# Altium schematic sheet MCU.SchDoc
size A4; SheetNumber: 2; SheetTotal: 8
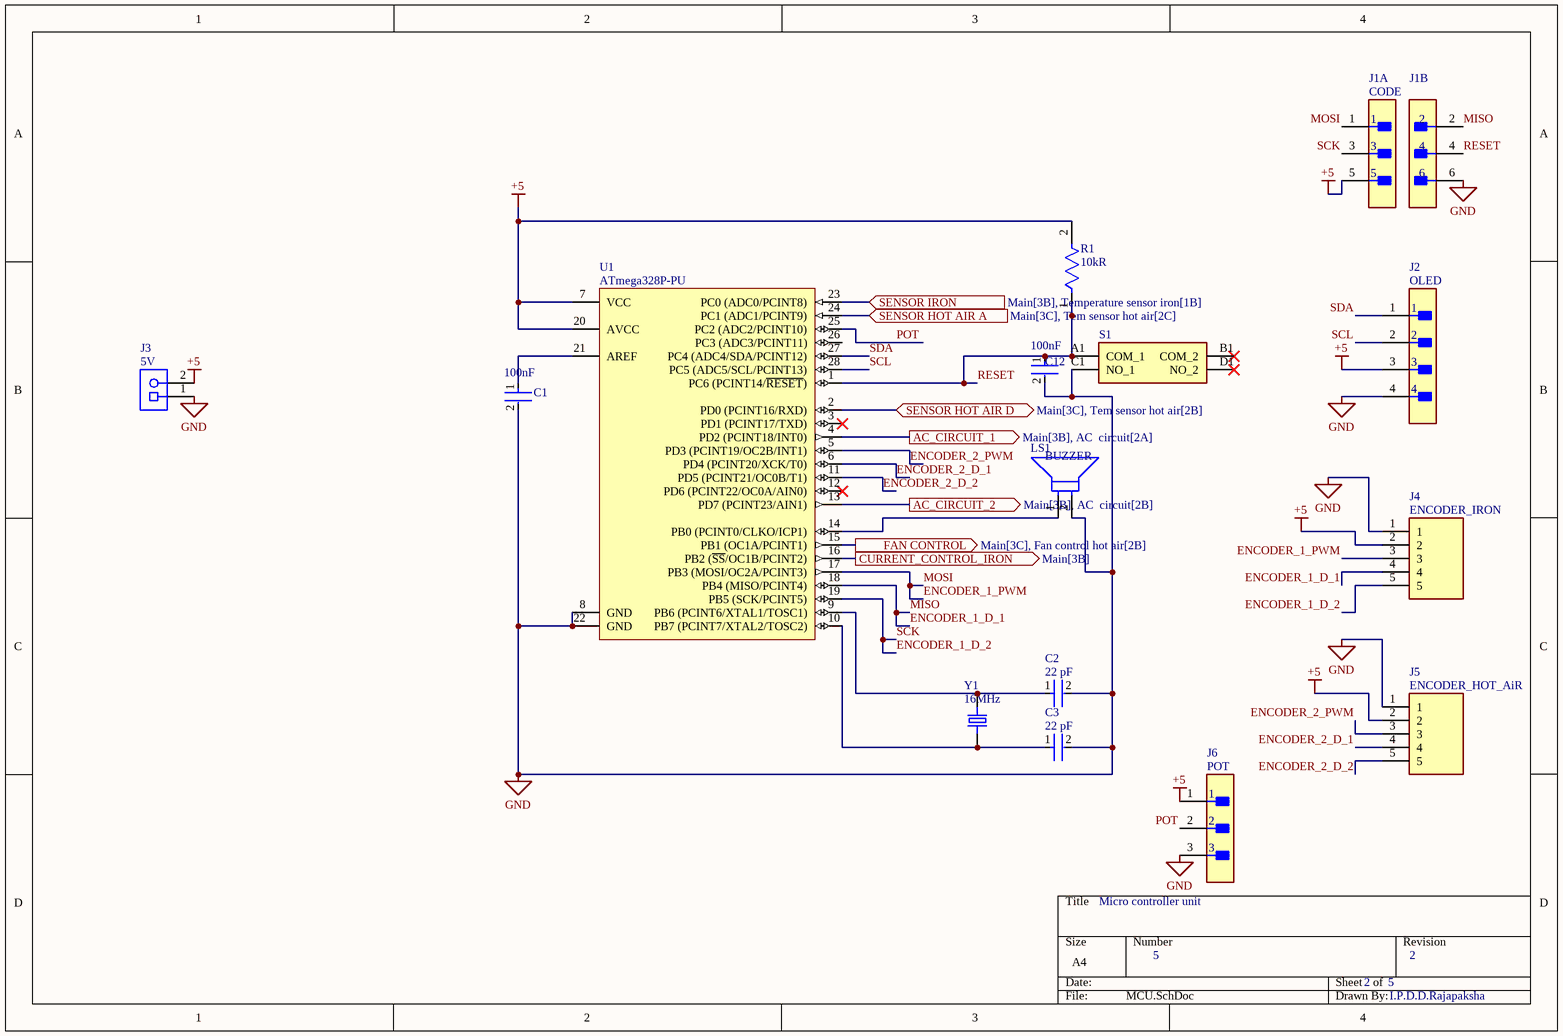
[diagram p0: MCU.SchDoc]

## Parts
C1  Capacitance: 100nF  [FP-0805-L_2_01_0_2-W_1_25-IPC_A]  (hidden comment: 0805YC104M4T2A)
C2  Capacitance: 22 pF  [FP-C0805C-DN-MFG]  (hidden comment: C0805C220J5GACTU)
C3  Capacitance: 22 pF  [FP-C0805C-DN-MFG]  (hidden comment: C0805C220J5GACTU)
C12  Capacitance: 100nF  [FP-0805-L_2_01_0_2-W_1_25-IPC_A]  (hidden comment: 0805YC104M4T2A)
J1  Parameter 1: CODE  [FP-90131-0763-MFG]  (hidden comment: 90131-0763)  (parts A,B of 2)
J2  value OLED  [FP-B4B-XH-A_LF_SN-MFG]  (hidden comment: B4B-XH-A(LF)(SN))
J3  Parameter 1: 5V  [PHOE-1729128-2_V]  (hidden comment: 1729128)
J4  Parameter 1: ENCODER_IRON  [B5BXHAMLFSN]  (hidden comment: B5B-XH-AM__LF__SN_)
J5  Parameter 1: ENCODER_HOT_AiR  [B5BXHAMLFSN]  (hidden comment: B5B-XH-AM__LF__SN_)
J6  Parameter 1: POT  [FP-B3B-XH-A_LF_SN-MFG]  (hidden comment: B3B-XH-A(LF)(SN))
LS1  Parameter 1: BUZZER  [FP-AI-1223-TWT-5V-R-MFG]  (hidden comment: AI-1223-TWT-5V-R)
R1  Resistance: 10kR  [FP-CRCW1206-e3-IPC_C]  (hidden comment: CRCW120610K0FKEA)
S1  TS-1187A-B-A-B  [TS1187ABAB]  (value not drawn)
U1  ATmega328P-PU  [28P3]
Y1  value 16MHz  [XTAL_ECS-160-20-4X]  (hidden comment: ECS-160-S-4)

## Ports
AC_CIRCUIT_1 (out, see Main[3B], AC  circuit[2A]), AC_CIRCUIT_2 (out, see Main[3B], AC  circuit[2B]), CURRENT_CONTROL_IRON (out, see Main[3B]), FAN CONTROL (out, see Main[3C], Fan control hot air[2B]), SENSOR HOT AIR A (in, see Main[3C], Tem sensor hot air[2C]), SENSOR HOT AIR D (bidir, see Main[3C], Tem sensor hot air[2B]), SENSOR IRON (in, see Main[3B], Temperature sensor iron[1B])

## Nets
+5: J1.5 J2.3 J3.2 J4.2 J5.2 J6.1 R1.2 U1.7(VCC) U1.20(AVCC)
GND: C1.2 C2.2 C3.2 C12.2 J1.6 J2.4 J3.1 J4.1 J5.1 J6.3 LS1.2(A) S1.C1(NO_1) U1.8(GND) U1.22(GND)
AC_CIRCUIT_1: U1.4(PD2_(PCINT18/INT0)) ; port AC_CIRCUIT_1
AC_CIRCUIT_2: U1.13(PD7_(PCINT23/AIN1)) ; port AC_CIRCUIT_2
CURRENT_CONTROL_IRON: U1.16(PB2_(~{SS}/OC1B/PCINT2)) ; port CURRENT_CONTROL_IRON
ENCODER_1_D_1: J1.2 J4.4 U1.18(PB4_(MISO/PCINT4))  [also labelled MISO]
ENCODER_1_D_2: J1.3 J4.5 U1.19(PB5_(SCK/PCINT5))  [also labelled SCK]
ENCODER_1_PWM: J1.1 J4.3 U1.17(PB3_(MOSI/OC2A/PCINT3))  [also labelled MOSI]
ENCODER_2_D_1: J5.4 U1.6(PD4_(PCINT20/XCK/T0))
ENCODER_2_D_2: J5.5 U1.11(PD5_(PCINT21/OC0B/T1))
ENCODER_2_PWM: J5.3 U1.5(PD3_(PCINT19/OC2B/INT1))
FAN CONTROL: U1.15(PB1_(OC1A/PCINT1)) ; port FAN CONTROL
POT: J6.2 U1.25(PC2_(ADC2/PCINT10))
RESET: C12.1 J1.4 R1.1 S1.A1(COM_1) U1.1(PC6_(PCINT14/~{RESET}))
SCL: J2.2 U1.28(PC5_(ADC5/SCL/PCINT13))
SDA: J2.1 U1.27(PC4_(ADC4/SDA/PCINT12))
SENSOR HOT AIR A: U1.24(PC1_(ADC1/PCINT9)) ; port SENSOR HOT AIR A
SENSOR HOT AIR D: U1.2(PD0_(PCINT16/RXD)) ; port SENSOR HOT AIR D
SENSOR IRON: U1.23(PC0_(ADC0/PCINT8)) ; port SENSOR IRON
NetC1_1: C1.1 U1.21(AREF)
NetC2_1: C2.1 U1.9(PB6_(PCINT6/XTAL1/TOSC1)) Y1.2
NetC3_1: C3.1 U1.10(PB7_(PCINT7/XTAL2/TOSC2)) Y1.1
NetLS1_1: LS1.1(C) U1.14(PB0_(PCINT0/CLKO/ICP1))

Not connected (* = marked no-connect by the designer): S1 B1(COM_2)* D1(NO_2)*; U1 3(PD1_(PCINT17/TXD))* 12(PD6_(PCINT22/OC0A/AIN0))* 26(PC3_(ADC3/PCINT11))

## Notes on the sheet
- (near J6) Micro controller unit
- 5
- 2      5
- 2
- I.P.D.D.Rajapaksha

## Library data of the parts
C1 C12 = CMP-04427-015812-1: Automotive Ceramic Capacitor, 0805, 100nF, 20%, X7R, 0.15, 16V; Termination: SMD/SMT; Case Code (Metric): 2012; Length: 0.079inch; Dielectric: X7R; Max Operating Temperature: 125°C; Thickness: 0.037inch; Ratings: AEC-Q200; Package Quantity: 4000; Weight: 0.000194oz; Voltage Rating: 16V; Voltage Rating (DC): 16V; Mount: Surface Mount; Width: 1.25mm; Packaging: Tape and Reel; Tolerance: 20%; Case/Package: 0805; Height: 0.94mm; Case Code (Imperial): 0805; Min Operating Temperature: -55°C
C2 C3 = CMP-2007-00048-2: Capacitor; Ceramic; Cap; 22.0pF; Tol 5%; SMT; Vol-Rtg 50V; C0G; Tape and Reel; Manufacturer: KEMET; Temperature Coefficient: 30ppm/°C; Value: 22 pF; Tolerance: 0.05; Device Class L1: Passive Components; Mouser Description: Multilayer Ceramic Capacitors MLCC - SMD/SMT 50volts 22pF C0G 5%; Temperature Range Low: -55°C; Automotive: No; Voltage Rating: 50 V; Material: Ceramic; Category: Cap; Height: 0.88mm; Temperature Range High: +125°C; Digikey Description: Capacitor; Ceramic; Cap; 22.0pF; Tol 5%; SMT; Vol-Rtg 50V; C0G; Tape and Reel; Octopart: https://octopart.com/c0805c220j5gactu-kemet-145470; ComponentLink2Description: Datasheet; Device Class L2: Capacitors; Ipc Land Pattern Name: CAPC200125X78; RoHS: TRUE; ComponentLink2URL: https://content.kemet.com/datasheets/KEM_C1003_C0G_SMD.pdf; Temperature: -55°C to +125°C; Device Class L3: Ceramic Capacitors; Lead Free: Yes; Manufacturer Part Number: C0805C220J5GACTU; Temperature Characteristic: C0G; Package: C0805C-DN
J1 = CMP-00257-00655468-1: 90131-0763 Conn Unshrouded Header HDR 6 POS 2.54mm Solder ST Top Entry Thru-Hole C-Grid III™ Tray; NexarPartId: 655468; Manufacturer Lifecycle Status: ACTIVE; Number of Poles: 6; Plating: Tin; Current Rating: 3A; Gender: Male; Voltage Rating (AC): 350V; Contact Resistance: 20mΩ; Insulation Resistance: 5GΩ; Pitch: 2.54mm; Height: 9.65mm; Mount: Through Hole; Termination: Through Hole; Contact Plating: Gold; Orientation: Vertical; Material: Glass, Polyester; Min Operating Temperature: -55°C; Lead Free: Lead Free; REACH SVHC: Unknown; Contact Material: Brass; Housing Color: Black; Schedule B: 8536694040; Number of Rows: 2; Lead Pitch: 2.54mm; Number of Circuits: 6; Number of Positions: 6; Lifecycle Status: Production; Max Operating Temperature: 125°C; Voltage Rating: 350V; Voltage Rating (DC): 350V; Country of Origin: SG; Housing Material: Polyester; RoHS: Compliant; Working Voltage: 350V; Number of Contacts: 6; Radiation Hardening: No
J2 = CMP-17439-000250-1: CONN HEADER VERT 4POS 2.5MM; Number of Contacts: 4; Contact Resistance: 20mR; Voltage Rating: 250V; Max Current Rating: 3A; Gender: Male; Wire/Cable Gauge: 22AWG; Mated Stacking Heights: 9.8mm; Insulation Resistance: 1GR; Orientation: Straight; Contact Type: Male Pin; Contact Finish - Mating: TIN; Series: XH; Max Voltage Rating (AC): 250V; Lead Pitch: 2.5mm; Contact Shape: Square; Insulation Color: Natural; Termination: Solder; Lead Free: Lead Free; Voltage Rating (AC): 250V; Number of Rows: 1; Flammability Rating: UL94 V-0; Number of Positions: 4; Max Operating Temperature: 85°C; Package Quantity: 500; Mount: Through Hole; REACH SVHC: No SVHC; Connector Type: Header; Insulation Material: Nylon; Fastening Type: Detent; Min Operating Temperature: -25°C; Housing Color: White; Packaging: Bulk; Contact Plating: Tin; Contact Material: Brass; Max Voltage Rating (DC): 250V; Housing Material: Polyamide; Color: Natural; Material: Polyamide; Pitch: 2.5mm; Depth: 5.75mm; Current Rating: 3A; Length: 12.4mm
J3 = CMP-2000-05815-1: PCB Terminal Block, 13.5 A, 400 V, 2-Pin THD, RoHS, Bulk; Manufacturer: Phoenix Contact; Package Version: 03/2015; No. of Rows: 1; Pitch: 5.08mm; No. of Positions: 2; Voltage Rating: 400V; Current Rating: 13500mA; Manufacturer URL: http://www.phoenixcontact.com/; Datasheet URL: https://datasheet.ciiva.com/16046/1729128-16046181.pdf; RoHS: TRUE; Package URL: https://www.phoenixcontact.com/online/portal/pi/pxc/product_detail_page/!ut/p/b1/3VdJjqNKFDxLH8AFycySyWY2ozFsEPOMMQaDOX1XedGL_1Vdm5YXJleknhSKeBkvI6EA8ncAo3AYoDhBQGco6KN7VURTdemj9us_IEKEZo_YHiPAEWEFmDGOHMORkqKYCORBZxgL7ZoaZYcbFFUZ3fqxSY6GOuxydWUuHqz1ynmMFygu583Bob0Ewr6Sd_l-5m-kAueHiB0jpRwZwe58wwtkpxtMYd_LmGcDRU02dRNEyWt6Y2ti5pSyJ_reIkzIulrqApdnbT11V5jnCKbYNCvhEM1MCpPByat_X379-iThf08CI5GfOPqfBeS3BRoBOdD55AKVv0iLwCMq-2BrzXWSGRH7pUGD9uwXQjiph3xL0DKQwdGa0JImiIOmBNOestqgwTHSSs2oOep-78apyXQBvNi8ZLaFjvjWvcaUEBu0MC6Wbe-d6mB0FAebo2lUWinqYaZs5DAYzV0RP9yitUjnGJ0iI9xhZkT42OCQNUJJhkgWINNQLP2JFP6OpMg3JCVg70jqHT0lvKOnhHf0lPuOnnLf0VPuWx6_dxwUIvwk5WMkT0kLL1mh61l2yZVSzG3pYV_bqo-mj6uMKwKwdnnW8Jh5RTOJzMOA5c-eJDaZQw4mTMPH02PvS_ZAqNVjVTo2WyYLkwH_KU1mmmG5kjRhDqPXLwwVHvVOjCM60-fpXvTDfMGW1PVFVS1r4e4yVDk4ZdNbkUHvqPqQSeian4UD39fNKmachqdJ1NJbyk8rXT9mXTvPk3oE5meulKGgiruPJek-4I9hTT6G8ZLOyRSm2RRVbThERQad5OS28hdt4YW4vG0stgYYzsWsK4_7y6DZMjJSCqri1kyiZR5vD7pwIrNR7QwPHTcLTI5qT7eRlpHrdGiupYlqQDJ7zy_CND8fWWBoLRXxk1RVcXiBQwbTD4Xi7KL-FuO94t9xaqweXzH; PartNumber: 1729128; Package Description: 2-Pin Through Hole Device, Body 8.1 x 10.16 mm, Pitch 5.08 mm; Datasheet Version: 12/2013; Mounting Technology: ThroughHole; Orientation: Horizontal; Package Reference: 1729128-2; Packing: Bulk
J4 J5 = B5B-XH-AM__LF__SN_: Connector; Manufacturer_Name: JST (JAPAN SOLDERLESS TERMINALS); Manufacturer_Part_Number: B5B-XH-AM (LF)(SN); Datasheet Link: http://uk.rs-online.com/web/p/products/1755317; Height: 7mm; Arrow Part Number: B5B-XH-AM (LF)(SN); Arrow Price/Stock: https://www.arrow.com/en/products/b5b-xh-am-lf-sn/jst-manufacturing
J6 = CMP-17439-000014-3: CONN HEADER VERT 3POS 2.5MM; Max Voltage Rating (DC): 250V; Number of Positions: 3; Current Rating: 3A; Gender: Male; Wire/Cable Gauge: 22AWG; Contact Resistance: 20mR; Insulation Resistance: 1GR; Insulation Material: Nylon; Contact Plating: Tin; Depth: 5.75mm; Contact Type: Male Pin; Max Operating Temperature: 85°C; Insulation Color: Natural; Voltage Rating (AC): 250V; Color: Natural; Connector Type: Header; Orientation: Straight; Fastening Type: Detent; Housing Color: White; Min Operating Temperature: -25°C; Termination: Solder; Voltage Rating: 250V; Series: XH; Pitch: 2.5mm; Contact Shape: Square; Number of Rows: 1; Lead Free: Lead Free; Packaging: Bulk; Mount: Through Hole; Flammability Rating: UL94 V-0; Max Voltage Rating (AC): 250V; REACH SVHC: No SVHC; Housing Material: Polyamide; Contact Material: Brass; Lead Pitch: 2.5mm; Contact Finish - Mating: TIN; Length: 9.9mm; Max Current Rating: 3A; Number of Contacts: 3
LS1 = CMP-231724-000001-1: AUDIO MAGNETIC INDICATOR 3-7V TH; Input Type: DC; Bandwidth: 2.3kHz; Nominal Supply Voltage (DC): 5V; Max Supply Current: 30mA; Washable: Yes; Max Supply Voltage (DC): 7V; Min Supply Voltage: 3V; Series: AI; Width: 12mm; REACH SVHC: No SVHC; Contact Plating: Tin; Frequency: 2.3kHz; Operating Supply Current: 30mA; Weight: 0.01lb; Current Rating: 30mA; Mount: Through Hole; Packaging: Tray; Length: 12mm; Lead Free: Lead Free; Color: Black; Input Current: 30mA; Min Operating Temperature: -40°C; Self Resonant Frequency: 2.3kHz; Sensing Method: Magnetic; Voltage Rating (DC): 5V; Height: 9.5mm; Termination: PC Pins; Min Supply Voltage (DC): 3V; Package Quantity: 100; Max Supply Voltage: 7V; Diameter: 12mm; Max Operating Temperature: 85°C
R1 = CMP-2003-04807-2: RES Thick Film, 10kΩ, 1%, 0.25W, 100ppm/°C, 1206; Working Voltage: 200V; Max Power Dissipation: 250mW; Tolerance: 1%; Width: 0.063inch; Height: 0.55mm; Number of Pins: 2; Voltage Rating: 200V; Temperature Coefficient: 100ppm/°C; Military Standard: Not; Features: Automotive AEC-Q200; Depth: 1.6mm; Radiation Hardening: No; Termination: SMD/SMT; Case Code (Imperial): 1206; Weight: 0.000353oz; Length: 3.2mm; Package Quantity: 10; Voltage Rating (DC): 200V; Case/Package: 1206; Min Operating Temperature: -55°C; Number of Terminations: 2; Composition: Thick Film; Contact Plating: Tin; Power Rating: 250mW; Packaging: Tape and Reel; Max Operating Temperature: 155°C; Lead Free: Lead Free; Case Code (Metric): 3216
S1 = TS-1187A-B-A-B: Switch; Manufacturer_Name: XKB Connectivity; Datasheet Link: http://www.helloxkb.com/public/images/pdf/TS-1187A-X-X-X.pdf; Height: 4.05mm; Manufacturer_Part_Number: TS-1187A-B-A-B
U1 = CMP-0095-00013-2: 8-bit AVR Microcontroller, 32KB Flash, 1KB EEPROM, 2KB SRAM, 28-pin PDIP, Industrial Grade (-40°C to 85°C); RevisionNote: DatasheetVersion updated. URLs added.; PackageVersion: revB, Sep-2001; PackageDescription: 28-lead (0.300"/7.62mm Wide) Plastic Dual Inline Package (PDIP); DatasheetVersion: revD, May-2011; ComponentLink1Description: Manufacturer URL; ComponentLink1URL: http://www.atmel.com/; PackageReference: 28P3; ComponentLink2Description: ATmega48A/48PA/88A/88PA/168A/168PA/328/328P Datasheet; ComponentLink3URL: http://www.atmel.com/dyn/resources/prod_documents/8271S.pdf; ComponentLink2URL: http://www.atmel.com/dyn/resources/prod_documents/8271.pdf; ComponentLink3Description: ATmega48A/48PA/88A/88PA/168A/168PA/328/328P Summary
Y1 = ECS-160-S-4: 16MHz Â±30ppm Crystal Series 40 Ohms HC-49/US; MF: ECS Inc.; SnapEDA_Link: https://www.snapeda.com/parts/ECS-160-S-4/ECS%20Inc./view-part/3657575/?ref=snap; Availability: Unavailable; Price: None; MP: ECS-160-S-4; Package: HC49/US ECS International